# EAGLE design SMATwoPort (EAGLE 7.2.0)
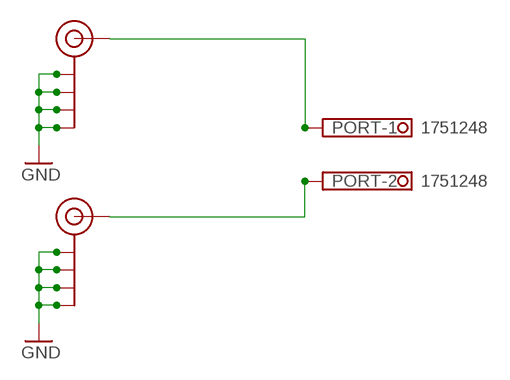
[diagram p0: schematic, sheet 1]

## Parts
J$1  SMA_EDGE  [SMA-EDGE]
J$2  SMA_EDGE  [SMA-EDGE]
PORT  1751248  [1751248]

## Nets
GND: J$1.GND@0(GND) J$1.GND@1(GND) J$1.GND@2(GND) J$1.GND@3(GND) J$2.GND@0(GND) J$2.GND@1(GND) J$2.GND@2(GND) J$2.GND@3(GND)
N$1: J$2.SIG(SIGNAL) PORT.1
N$2: J$1.SIG(SIGNAL) PORT.2

## Library data of the parts
J$1 J$2 = sparkfun-connectors:SMA_EDGE: SMA Antenna Connector End launch SMA connector. The paste layer has been removed so that the connector can be hand soldered onto the board after reflow.
PORT = con-phoenix-350:1751248: MKDS 1/ 2-3,5 Printklemme Nennstrom: 10 A Bemessungsspannung: 160 V Raster: 3,5 mm Polzahl: 2 Montageart: Löten Anschlussart: Schraubanschluss Anschlussrichtung vom Leiter zur Platine: 0° Source: http://eshop.phoenixcontact.com .. 1751248.pdf; OC_FARNELL: unknown; OC_NEWARK: unknown

## Net classes
0 default: width 0.762 mm, clearance 0.762 mm

## Board
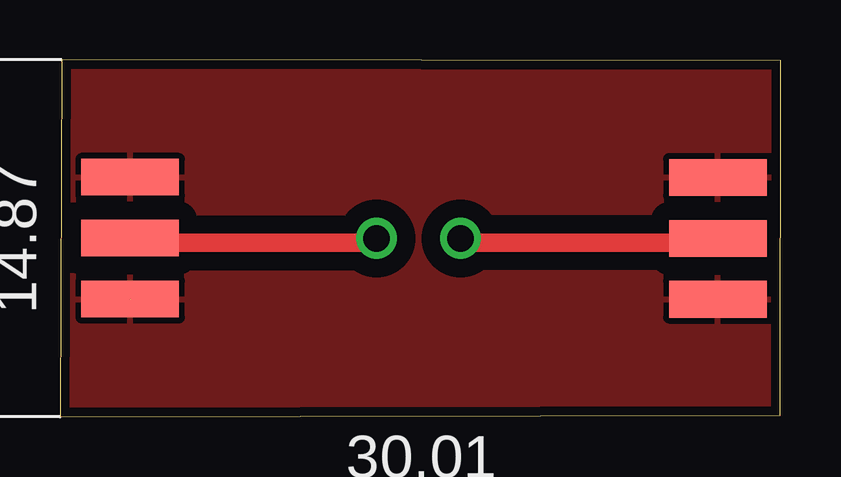
[diagram p1: board, top side]
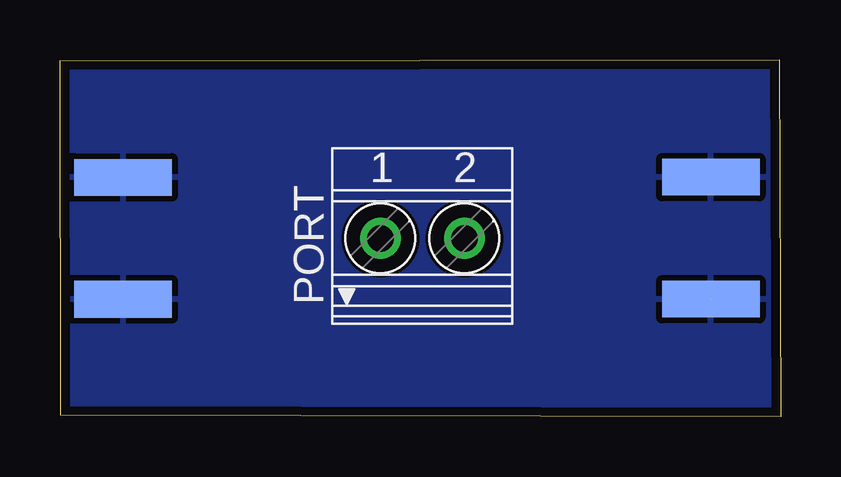
[diagram p2: board, bottom side, seen from below]

Size 30.04 x 14.87 mm. Coordinates in mm from the lower left corner, seen from the top.
Outline: 0,0 30,0.06 30.04,14.83 0.07,14.87 0,0
Copper layers (1*16): Top 0.0356mm / dielectric 1.5011mm / Bottom 0.0356mm
Design rules "oshpark-2layer": minimum track width 6mil, minimum drill 13mil, track to track 6mil, track to pad 6mil, pad to pad 6mil, via to via 6mil, smd to smd 6mil, copper to edge 15mil, drill to drill 6mil, minimum pad ring 7mil, minimum via ring 7mil, stop-mask expansion 4mil, vias tented up to drill 0mil, thermal gap 10mil

### Footprints (pad centres in the part's own frame; a part is rotated, then mirrored left to right if it is on the bottom)
SMA-EDGE = smd 1.524 x 4.064: GND@0 0,0; GND@1 5.08,0; SIG 2.54,0 | smd 1.524 x 4.064 bottom: GND@2 0,0; GND@3 5.08,0
1751248 = drill 1.1 pad 1.7: 1 -1.75,-0.1; 2 1.75,-0.1

### Placement (x,y rotation side)
J$1  2.92,9.99 270 top
J$2  27.41,4.9 90 top
PORT  14.94,7.54 0 bottom

### Tracks (layer width: path | path; a pad name or v marks a point on that pad's centre or on a via)
GND  (1 unrouted)
  pour Bottom: 0.29,14.71 29.82,14.53 29.89,0.14 0.24,0.22
  pour Top: 0.33,14.61 29.81,14.56 29.81,0.22 0.26,0.2
N$1
  Top 0.762: PORT.1 16.75,7.25 27.25,7.25 J$2.SIG
N$2
  Top 0.762: PORT.2 13,7.25 3,7.25 J$1.SIG